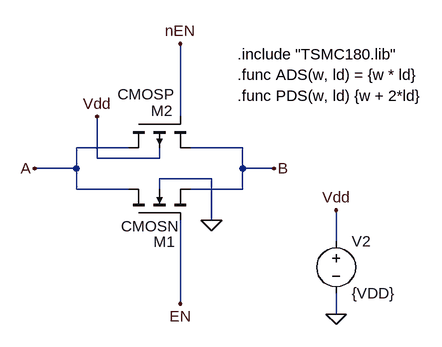
[diagram p0: schematic tgate.asc]
tgate.asc, the LTspice schematic file:
Version 4
SHEET 1 1436 972
WIRE 672 336 672 224
WIRE 592 384 512 384
WIRE 768 384 688 384
WIRE 544 400 544 336
WIRE 640 400 640 384
WIRE 640 400 544 400
WIRE 512 416 512 384
WIRE 512 416 448 416
WIRE 768 416 768 384
WIRE 816 416 768 416
WIRE 720 432 640 432
WIRE 512 448 512 416
WIRE 592 448 512 448
WIRE 640 448 640 432
WIRE 768 448 768 416
WIRE 768 448 688 448
WIRE 720 496 720 432
WIRE 912 528 912 480
WIRE 672 624 672 496
WIRE 912 640 912 608
FLAG 912 480 Vdd
FLAG 912 640 0
FLAG 672 624 EN
FLAG 672 224 nEN
FLAG 816 416 B
FLAG 448 416 A
FLAG 544 336 Vdd
FLAG 720 496 0
SYMBOL voltage 912 512 R0
WINDOW 123 0 0 Left 0
WINDOW 39 0 0 Left 0
SYMATTR InstName V2
SYMATTR Value {VDD}
SYMBOL nmos4 592 496 R270
WINDOW 0 -33 39 VRight 2
WINDOW 3 -9 -11 VRight 2
SYMATTR InstName M1
SYMATTR Value CMOSN
SYMATTR Value2 l={L} w={W} ad={ADS(W,LD)} as={ADS(W,LD)} pd={PDS(W,LD)} ps={PDS(W,LD)}
SYMBOL pmos4 592 336 M90
WINDOW 0 -9 69 VLeft 2
WINDOW 3 -34 71 VLeft 2
SYMATTR InstName M2
SYMATTR Value CMOSP
SYMATTR Value2 l={L} w={W} ad={ADS(W,LD)} as={ADS(W,LD)} pd={PDS(W,LD)} ps={PDS(W,LD)}
TEXT 760 240 Left 2 !.include "TSMC180.lib"
TEXT 760 272 Left 2 !.func ADS(w, ld) = {w * ld}
TEXT 760 304 Left 2 !.func PDS(w, ld) {w + 2*ld}

The netlist it stands for:
* tgate.asc
V2 Vdd 0 {VDD}
M1 A EN B 0 CMOSN l={L} w={W} ad={ADS(W,LD)} as={ADS(W,LD)} pd={PDS(W,LD)} ps={PDS(W,LD)}
M2 A nEN B Vdd CMOSP l={L} w={W} ad={ADS(W,LD)} as={ADS(W,LD)} pd={PDS(W,LD)} ps={PDS(W,LD)}
.model NMOS NMOS
.model PMOS PMOS
.lib standard.mos
.include "TSMC180.lib"
.func ADS(w, ld) = {w * ld}
.func PDS(w, ld) {w + 2*ld}
.backanno
.end